# EasyEDA Pro project ByByte_nano.epro, schematic main
Board Name: Board1; Create Date: 2025-09-03; Page Name: P1; Project Name: Бабай (ByByte) Nano; Schematic Name: main; Update Date: 2026-05-24; Company: EasyEDA.com; Page Size: A4; Version: V1.0
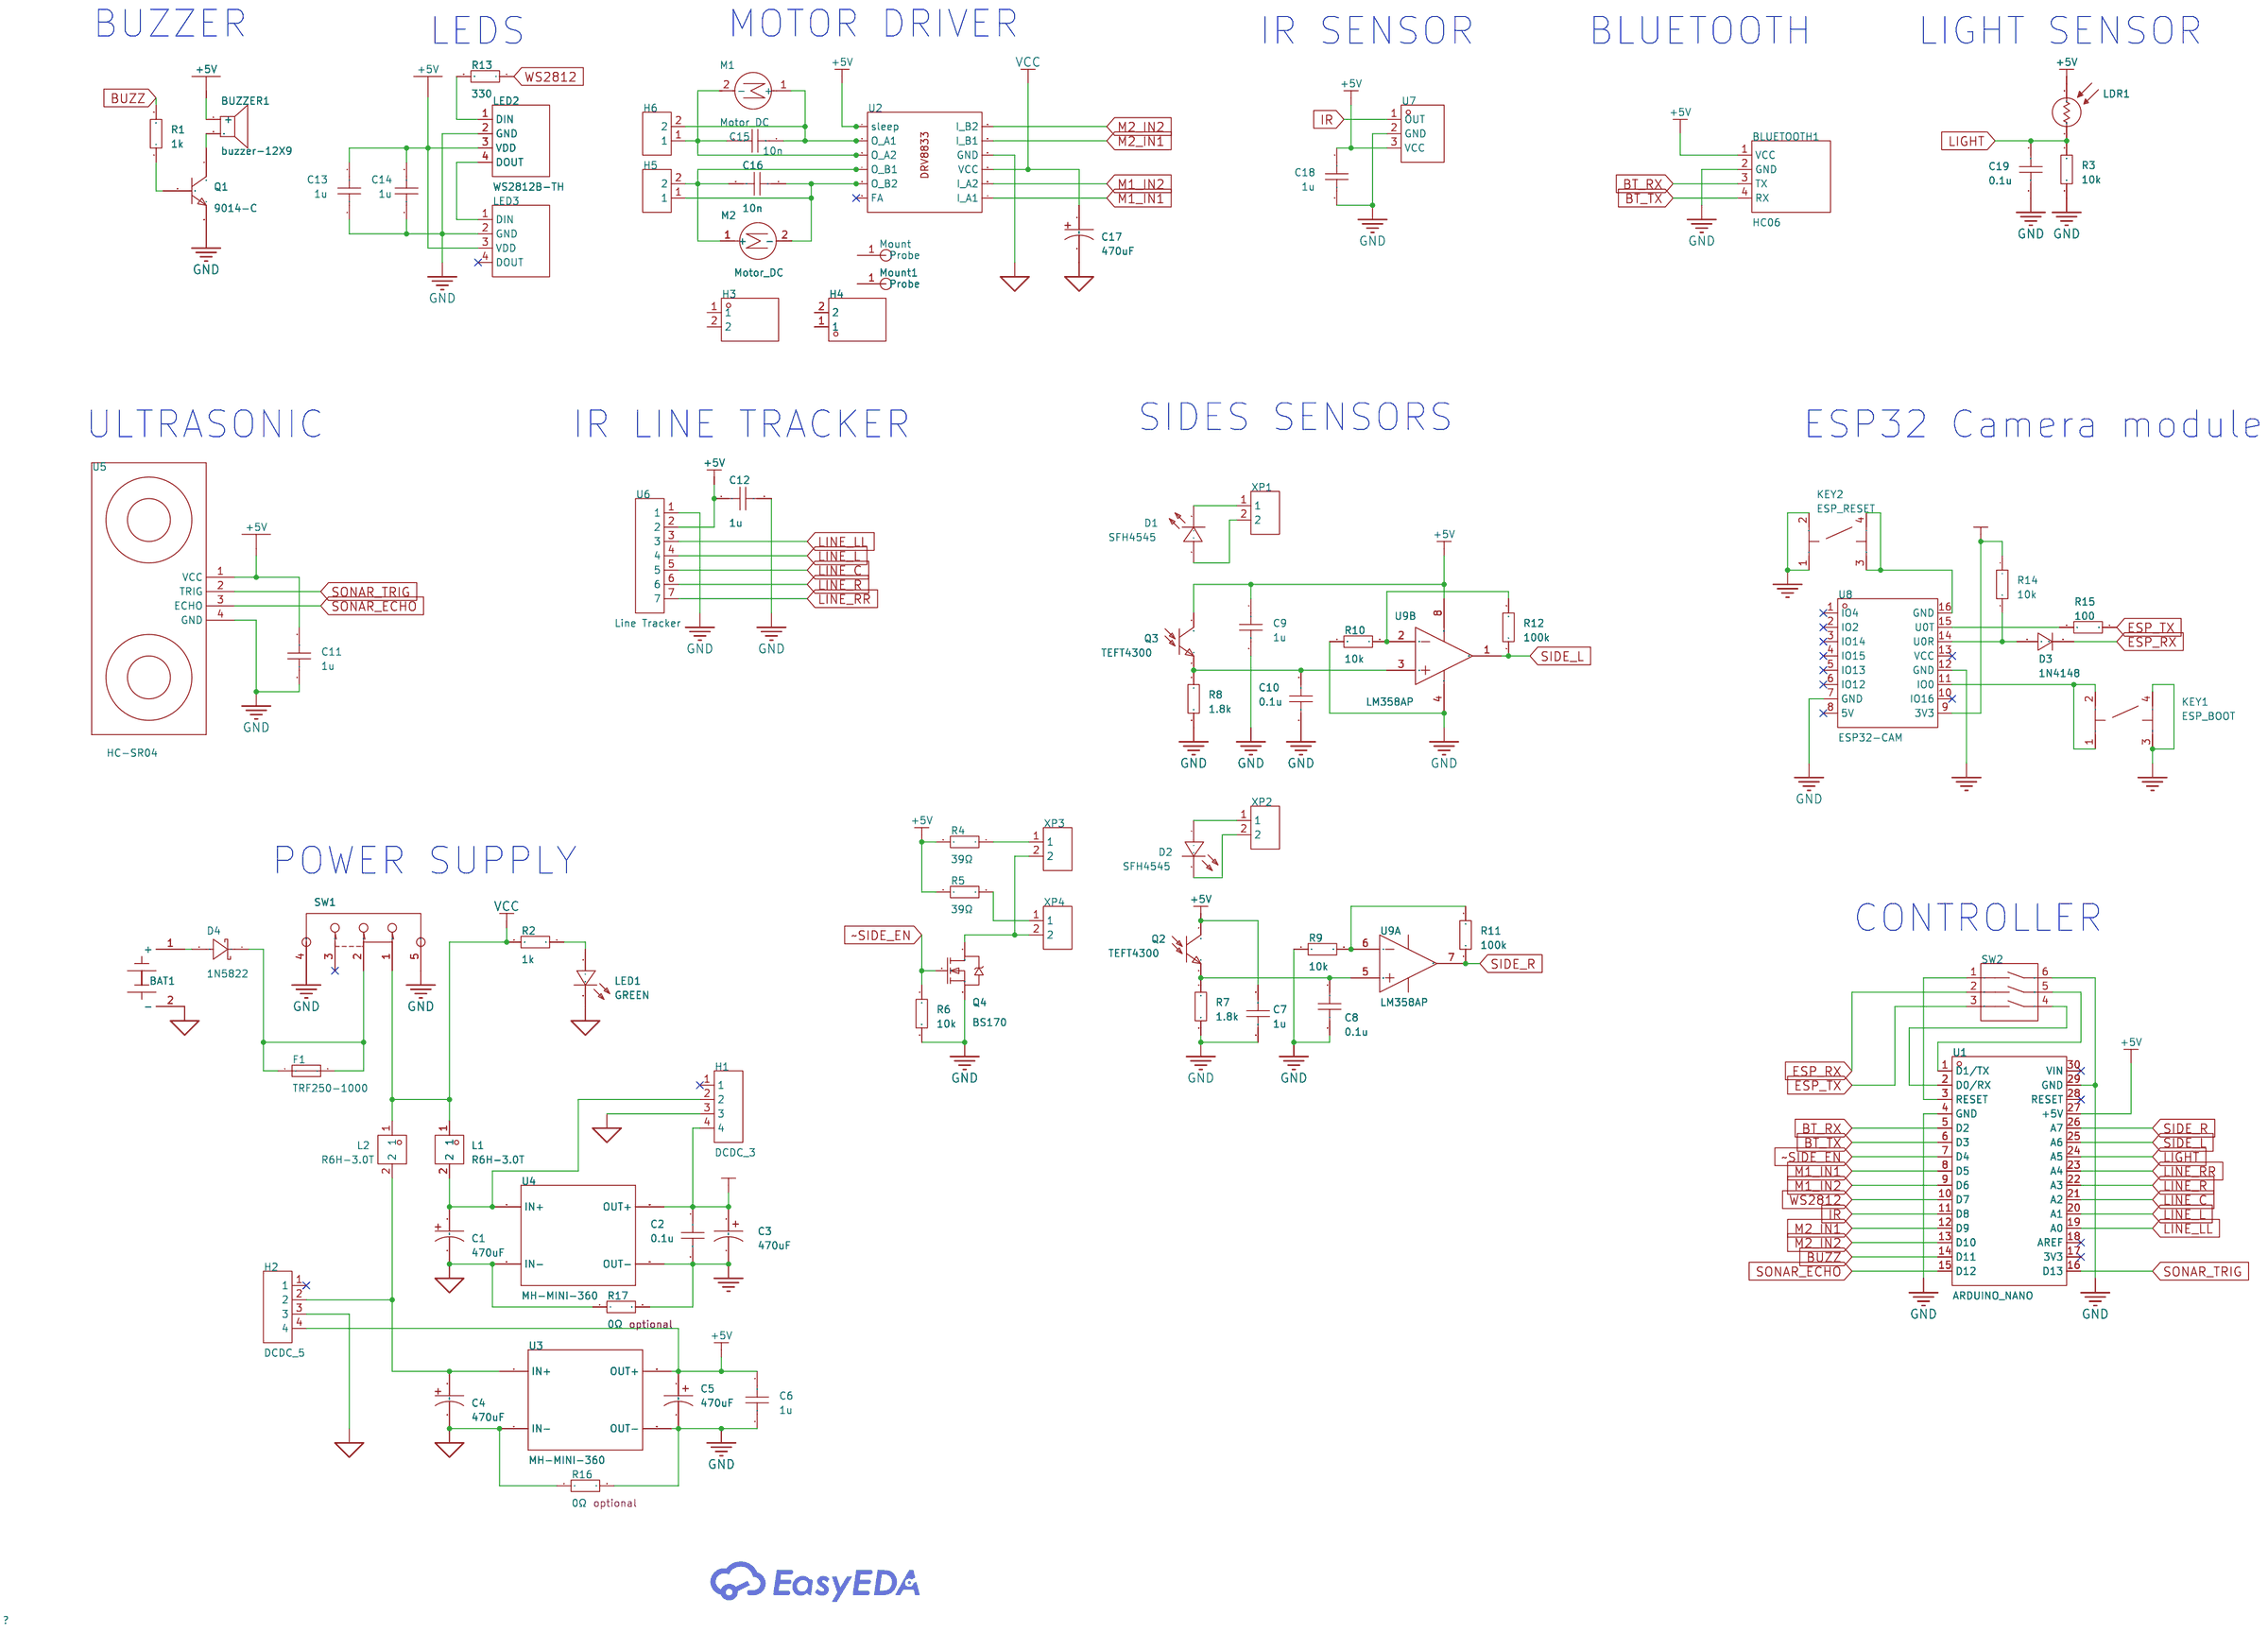
[diagram p0: schematic sheet]

## Parts
BAT1  -  [9V BATTERY]
BLUETOOTH1  HC06  [HC06]
BUZZER1  buzzer-12X9  [BUZ-TH_BD12.0-P7.60-D0.6-FD]
C1  470uF  [CAP-TH_BD8.0-P3.50-D0.6-FD-2]
C2  0.1u  [CAP-TH_L5.0-W2.5-P5.00-D1.0]
C3  470uF  [CAP-TH_BD6.3-P2.50-D1.0-FD]
C4  470uF  [CAP-TH_BD8.0-P3.50-D0.6-FD-2]
C5  470uF  [CAP-TH_BD6.3-P2.50-D1.0-FD]
C6  1u  [CAP-TH_L5.0-W2.5-P5.00-D1.0]
C7  1u  [CAP-TH_L5.0-W2.5-P5.00-D1.0]
C8  0.1u  [CAP-TH_L4.0-W2.5-P2.50-D0.5]
C9  1u  [CAP-TH_L5.0-W2.5-P5.00-D1.0]
C10  0.1u  [CAP-TH_L5.0-W2.5-P5.00-D1.0]
C11  1u  [CAP-TH_L5.0-W2.5-P5.00-D1.0]
C12  1u  [CAP-TH_L5.0-W2.5-P5.00-D1.0]
C13  1u  [CAP-TH_L5.0-W2.5-P5.00-D1.0]
C14  1u  [CAP-TH_L5.0-W2.5-P5.00-D1.0]
C15  10n  [CAP-TH_L4.0-W2.5-P2.50-D0.5]
C16  10n  [CAP-TH_L4.0-W2.5-P2.50-D0.5]
C17  470uF  [CAP-TH_BD8.0-L11.5-P3.50-D0.60]
C18  1u  [CAP-TH_L5.0-W2.5-P5.00-D1.0]
C19  0.1u  [CAP-TH_L4.0-W2.5-P2.50-D0.5]
D1  SFH4545  [LED-TH_BD5.0-P2.54-FD]
D2  SFH4545  [LED-TH_BD5.0-P2.54-FD]
D3  1N4148  [DO-35_BD2.0-L4.0-P8.0-D0.5-RD]
D4  1N5822  [Diode_THT:D_DO-15_P5.08mm_Vertical_KathodeUp]
F1  TRF250-1000  [FUSE-TH_L13.5-W3.7-P5.00-D0.8-S1.80]
H1  DCDC_3  [HDR-TH_4P-P2.54-V-F]
H2  DCDC_5  [HDR-TH_4P-P2.54-V-F]
H3  A2541HWR-2P  [HDR-TH_2P-P2.54-H-W8.7_A2541HWR-2P]
H4  A2541HWR-2P  [HDR-TH_2P-P2.54-H-W8.7_A2541HWR-2P]
H5  Jumper2  [HDR-TH_2P-P2.54-V-M-1]
H6  Jumper2  [HDR-TH_2P-P2.54-V-M-1]
KEY1  ESP_BOOT  [KEY-TH_4P-L6.0-W6.0-P6.50-LS4.5]
KEY2  ESP_RESET  [KEY-TH_4P-L6.0-W6.0-P6.50-LS4.5]
L1  R6H-3.0T  [TH_R6H-610-3T]
L2  R6H-3.0T  [TH_R6H-610-3T]
LDR1  -  [PHOTO_RESISTOR]
LED1  PWR  [LED-TH_BD3.0-P2.54-FD-GREEN]
LED2  WS2812B-TH  [LED-TH_4P-BD5.8_WS2812B-TH]
LED3  WS2812B-TH  [LED-TH_4P-BD5.8_WS2812B-TH]
M1  Motor_DC  [N20_DC_MOTOR 3D]
M2  Motor_DC  [N20_DC_MOTOR 3D]
Mount  -  [PROBE_PAD]
Mount1  -  [PROBE_PAD]
Q1  9014-C  [TO-92-3_L4.8-W3.7-P2.54-R]
Q2  TEFT4300  [SENSOR-TH_TEFT4300]
Q3  TEFT4300  [SENSOR-TH_TEFT4300]
Q4  BS170  [TO-92-3_L4.8-W3.7-P2.54-L]
R1  1k  [RES-TH_BD2.2-L6.5-P10.50-D0.6]
R2  1k  [RES-TH_BD1.8-L3.2-P7.20-D0.4]
R3  10k  [RES-TH_BD1.8-L3.2-P7.20-D0.4]
R4  39Ω  [R_AXIAL-0.4]
R5  39Ω  [R_AXIAL-0.4]
R6  10k  [RES-TH_BD1.8-L3.2-P7.20-D0.4]
R7  1.8k  [RES-TH_BD1.8-L3.2-P7.20-D0.4]
R8  1.8k  [RES-TH_BD1.8-L3.2-P7.20-D0.4]
R9  10k  [RES-TH_BD1.8-L3.2-P7.20-D0.4]
R10  10k  [RES-TH_BD1.8-L3.2-P7.20-D0.4]
R11  100k  [RES-TH_BD1.8-L3.2-P7.20-D0.4]
R12  100k  [RES-TH_BD1.8-L3.2-P7.20-D0.4]
R13  330  [RES-TH_BD1.8-L3.2-P7.20-D0.4]
R14  10k  [RES-TH_BD1.8-L3.2-P7.20-D0.4]
R15  100  [RES-TH_BD1.8-L3.2-P7.20-D0.4]
R16  0Ω  [RES-TH_BD1.8-L3.2-P7.20-D0.4]
R17  0Ω  [RES-TH_BD1.8-L3.2-P7.20-D0.4]
SW1  SW-TH_HOOYA_SS-12D11G4  [SW-TH_HOOYA_SS-12D11G4]
SW2  KF1001-03P-B0-GL-DFT-01B  [SW-TH_6P-L9.9-W9.0-P2.54-LS7.6_BLUE]
U1  ARDUINO_NANO  [COMM-TH_ARDUINO_NANO]
U2  -  [DRV8833]
U3  MH-MINI-360  [DC-DC-STEP-DOWN-MP2307]
U4  MH-MINI-360  [DC-DC-STEP-DOWN-MP2307]
U5  HC-SR04  [ULTRASONIC-HC-SR04#V]
U6  Line Tracker  [HDR-TH_7P-P2.54-V-F]
U7  D38  [OPTO-TH_VS1838B]
U8  ESP32-CAM  [COMM-TH_16P-L40.0-W27.0-P2.54_ESP32-CAM]
U9  LM358AP  [DIP-8_L9.7-W6.4-P2.54-LS7.6-BL]  (sections 1,2)
XP1  Jumper2  [HDR-TH_2P-P2.54-V-M-1]
XP2  Jumper2  [HDR-TH_2P-P2.54-V-M-1]
XP3  Jumper2  [HDR-TH_2P-P2.54-V-M-1]
XP4  Jumper2  [HDR-TH_2P-P2.54-V-M-1]

## Library data of the parts
BAT1 = BH9VPC: https://www.digikey.com/en/products/detail/mpd-memory-protection-devices/BH9VPC/31510
BLUETOOTH1 = HC06: Supplier: LCSC; _: 3
BUZZER1 = BUZZER-12X9: Supplier Part: C9900016920; Supplier Footprint: BUZZER_SMT_9650B; Datasheet: https://atta.szlcsc.comnull; Supplier: LCSC
C1 C4 C17 = RXW471M1CBK-0811: Capacitance:470uF Tolerance:±20% Tolerance:±20% Voltage Rating:16V Ripple Current:- Equivalent Series Resistance(ESR):- Pin Spacing:3.5mm Diameter:8mm Height - Seated (Max):11.5mm Lifetime:5000hrs@105℃; LCSC Part Name: 470uF ±20% 16V; Supplier Part: C134658; Manufacturer: Lelon(立隆); Supplier Footprint: 插件,D8xL11.5mm; JLCPCB Part Class: Extended Part; Datasheet: https://atta.szlcsc.com/upload/public/pdf/source/20190613/C384650_EFEC9297B5607DDE202AAAD5E3F76F5E.pdf; Supplier: LCSC; Tolerance: ±20%; Voltage Rating: 16V; Pin Spacing: 3.5mm; Diameter: 8mm; Height - Seated (Max): 11.5mm; Lifetime: 5000hrs@105℃
C2 C6 C7 C9-C14 C18 = 100nF: Supplier Part: C9900015256; JLCPCB Part Class: Extended Part; Supplier: LCSC
C3 C5 = SHW470UF6.3V6.3X11: Capacitance:470uF Tolerance:±20% Tolerance:±20% Voltage Rating:6.3V Ripple Current:- Equivalent Series Resistance(ESR):- Pin Spacing:2.5mm Diameter:6.3mm Height - Seated (Max):11mm Lifetime:10000hrs@105℃; LCSC Part Name: 470uF ±20% 6.3V 停产; Supplier Part: C494546; Manufacturer: KNSCHA(科尼盛); Supplier Footprint: 插件,D6.3xL11mm; JLCPCB Part Class: Extended Part; Datasheet: https://item.szlcsc.com/datasheet/SHW470UF6.3V6.3X11/505122.html; Supplier: LCSC; Tolerance: ±20%; Voltage Rating: 6.3V; Pin Spacing: 2.5mm; Diameter: 6.3mm; Height - Seated (Max): 11mm; Lifetime: 10000hrs@105℃
C8 C15 C16 C19 = FK18X5R1C105K: Capacitance: Tolerance:±10% Tolerance:±10% Voltage Rated: Temperature Coefficient:; LCSC Part Name: 1uF ±10% 16V; Supplier Part: C3693472; Manufacturer: TDK; JLCPCB Part Class: Extended Part; Datasheet: https://atta.szlcsc.com/upload/public/pdf/source/20171113/C140866_15105613015131115783.pdf; Supplier: LCSC; Tolerance: ±10%
D1 D2 = SFH4550: Supplier Part: C706747; Supplier: LCSC
D3 = 1N4148: Diode Configuration: Forward Voltage (Vf@If):- Reverse Voltage (Vr):- Average Rectified Current (Io):- Reverse Leakage Current:-; Supplier Part: C13769; Supplier Footprint: DO-35; JLCPCB Part Class: Extended Part; Supplier: LCSC
D4 = SR260: Diode Configuration:- Forward Voltage (Vf@If):700mV@2A Reverse Voltage (Vr):60V Rectified Current:2A Reverse Leakage Current (Ir):500uA@60V; LCSC Part Name: 电压:60V 电流:2A 停产; Supplier Part: C845406; Manufacturer: TF(拓锋); Supplier Footprint: DO-15; JLCPCB Part Class: Extended Part; Datasheet: https://atta.szlcsc.com/upload/public/pdf/source/20201103/C845406_FC0B483EC48C96AC55EDB1AB9BB06A33.pdf; Supplier: LCSC; Forward Voltage (Vf@If): 700mV@2A; Reverse Voltage (Vr): 60V; Rectified Current: 2A; Reverse Leakage Current (Ir): 500uA@60V
F1 = TRF250-1000: Supplier Part: C9900004495; Supplier Footprint: 插件; JLCPCB Part Class: Extended Part; Supplier: LCSC
H1 H2 = HC-08蓝牙: Supplier Part: C9900016778; Supplier Footprint: HDR-TH_4P; JLCPCB Part Class: Extended Part; Supplier: LCSC
H3 H4 = A2541HWR-2P: Holes Structure:1x2P Pitch:2.54mm Row Spacing:- Circular Hole / Square Hole:方孔 Mounting Type:Right-Angle Number of Rows:Plugin Number of Holes:2P Current Rating (Max):3A Voltage Rating (Max):250V Holes Direction:side Insulation Height:2.5mm Contact Materi; LCSC Part Name: 1x2P 间距:2.54mm 弯插; Supplier Part: C225510; Manufacturer: CJT(长江连接器); Supplier Footprint: 弯插,P=2.54mm; JLCPCB Part Class: Extended Part; Datasheet: https://atta.szlcsc.com/upload/public/pdf/source/20180724/C239359_48B1BC0CA1B4E4396A63955AAFD15564.pdf; Supplier: LCSC; Holes Structure: 1x2P; Pitch: 2.54mm; Circular Hole / Square Hole: 方孔; Mounting Type: Right-Angle; Number of Rows: Plugin; Number of Holes: 2P; Current Rating (Max): 3A; Voltage Rating (Max): 250V; Holes Direction: side; Insulation Height: 2.5mm; Contact Material: Brass; Contact Plating: Gold; Operating Temperature Range: -40℃~+105℃; PIN Length: 3.2mm
H5 H6 XP1-XP4 = Jumper2: Supplier Part: C2940092; Supplier Footprint: HDR-TH-2P-2.54mm; JLCPCB Part Class: Extended Part; Supplier: LCSC
KEY1 KEY2 = AN6*6: Supplier Part: C9900018275; Supplier Footprint: KEY-TH_4P-L6.0-W6.0-P4.50-LS6.50; JLCPCB Part Class: Extended Part; Supplier: LCSC
L1 L2 = R6H-6*10 -3T: Supplier Part: C2895497; Supplier Footprint: TH-2_P3.50mm; Supplier: LCSC
LDR1 = Photo-Resistor
LED1 = 插针式LEDF3: Supplier Part: C9900017231; Manufacturer Part: GREEN; Supplier Footprint: LED-TH_BD3.0; JLCPCB Part Class: Extended Part; Supplier: LCSC
LED2 LED3 = WS2812B-TH: Supplier: LCSC; Supplier Part: C9900193997; Supplier Footprint: 插件
M1 M2 = Motor_DC: license: https://www.gnu.org/licenses/lgpl-2.1.html
Mount Mount1 = Probe
Q1 = 9014-C: type:NPN Current - Collector(Ic): Collector - Emitter Voltage VCEO: Pd - Power Dissipation: DC Current Gain:200@1mA,5V DC Current Gain:200@1mA,5V Transition frequency(fT):270MHz Current - Collector Cutoff:50nA Vce Saturation(VCE(sat)):140mV Operating Temp; Supplier Part: C305409; Manufacturer: BLUE ROCKET(蓝箭); Supplier Footprint: TO-92-3; Datasheet: https://atta.szlcsc.com/upload/public/pdf/source/20181016/C305409_957E989EA97400765401B68B49A4FDD8.pdf; Supplier: LCSC; type: NPN; DC Current Gain: 200@1mA,5V; Transition frequency(fT): 270MHz; Current - Collector Cutoff: 50nA; Vce Saturation(VCE(sat)): 140mV
Q2 Q3 = TEFT4300: Transistor Type:NPN Collector Emitter Voltage:70V Collector Emitter Voltage:70V Collector Current (Ic):50mA Dissipation Power(Max):100mW Collector Dark Current:1nA Peak Wavelength:925nm Viewing Angle:±30° Operating Temperature:-40℃~+100℃ Operating Tempera; LCSC Part Name: 925nm的NPN光电三极管; Supplier Part: C118301; Manufacturer: VISHAY(威世); Supplier Footprint: 插件,D=3mm; JLCPCB Part Class: Extended Part; Datasheet: https://atta.szlcsc.com/upload/public/pdf/source/20170713/C118301_1499918878961816729.pdf; Supplier: LCSC; Transistor Type: NPN; Collector Emitter Voltage: 70V; Collector Current (Ic): 50mA; Dissipation Power(Max): 100mW; Collector Dark Current: 1nA; Peak Wavelength: 925nm; Viewing Angle: ±30°; Operating Temperature: -40℃~+100℃
Q4 = BS170-D26Z: Type:1 N-Channel Drain Source Voltage (Vdss): Continuous Drain Current (Id): Drain Source On Resistance (RDS(on)@Vgs,Id):5Ω@10V,200mA Power Dissipation (Pd): Gate Threshold Voltage (Vgs(th)@Id):3V@1mA Input Capacitance (Ciss@Vds):40pF@10V Operating Temper; LCSC Part Name: 1个N沟道 耐压:60V 电流:500mA; Supplier Part: C258163; Manufacturer: onsemi(安森美); Supplier Footprint: TO-92-3; JLCPCB Part Class: Extended Part; Datasheet: https://atta.szlcsc.com/upload/public/pdf/source/20180829/C258163_1806696338258A85C7E3E0B8B7F025DB.pdf; Supplier: LCSC; Type: 1 N-Channel; Drain Source On Resistance (RDS(on)@Vgs,Id): 5Ω@10V,200mA; Gate Threshold Voltage (Vgs(th)@Id): 3V@1mA; Input Capacitance (Ciss@Vds): 40pF@10V; Operating Temperature: -55℃~+150℃@(Tj)
R1 = CFR0W4J0102A50: Type:Carbon Resister Resistance:1000Ω Tolerance:±5% Tolerance:±5% Overload Voltage (Max):250V Power(Watts):0.25W; LCSC Part Name: 1kΩ ±5% 250mW 碳膜电阻; Supplier Part: C61293; Supplier Footprint: 插件; JLCPCB Part Class: Extended Part; Supplier: LCSC; Type: Carbon Resister; Tolerance: ±5%; Overload Voltage (Max): 250V; Power(Watts): 0.25W
R2 R3 R6-R15 = Res_AXIAL-1/8W: Supplier Footprint: Through
R4 R5 = Res_AXIAL-1/4W: Supplier Footprint: Through
R16 R17 = Res_AXIAL-1/8W: optional; Supplier Footprint: Through
SW1 = SW-TH_HOOYA_SS-12D11G4: link: https://atta.szlcsc.com/upload/public/pdf/source/20220518/EE8C01AB75DB93BD50D8A6D13330ACA3.pdf
SW2 = KF1001-03P-B0-GL-DFT-01B: Type:Slide, Rocked Circuit:SPST Number of Positions:3 Lead Pitch:2.54mm Current Rating:25mA Voltage Rating:24V Operating Temperature:-40℃~+85℃ Operating Temperature:-40℃~+85℃ Operating Life:2,000 cycles; LCSC Part Name: 2.54mm 平拨,凸起式 3位; Supplier Part: C2897603; Manufacturer: 凯峰; Supplier Footprint: 插件; JLCPCB Part Class: Extended Part; Datasheet: https://item.szlcsc.com/datasheet/KF1001-03P-B0-GL-DFT-01B/3143633.html; Supplier: LCSC; Type: Slide, Rocked; Circuit: SPST; Number of Positions: 3; Lead Pitch: 2.54mm; Current Rating: 25mA; Voltage Rating: 24V; Operating Temperature: -40℃~+85℃; Operating Life: 2,000 cycles
U1 = ARDUINO_NANO: Supplier Part: C9900017879; Supplier Footprint: 插件; JLCPCB Part Class: Extended Part; Supplier: LCSC
U2 = DRV8833
U3 U4 = #promini_DC-DC-STEP-DOWN-MP2307_
U5 = ULTRASONIC-HC-SR04_#V
U6 = 7位插座: Supplier Part: C9900023763; Supplier Footprint: HDR-TH-7P; JLCPCB Part Class: Extended Part; Supplier: LCSC
U7 = VS1838B: Supplier Part: C9900002107; Supplier Footprint: TH-3_4.8X6.7X2.54P; Supplier: LCSC
U8 = ESP32-CAM: ESP32-CAM_AI-THINKER; Supplier Part: C277946; Manufacturer: Ai-Thinker(安信可); Supplier Footprint: 插件; JLCPCB Part Class: Extended Part; Datasheet: https://atta.szlcsc.com/upload/public/pdf/source/20180906/C277946_000C39242C68478A3C556AF60BF76A1F.pdf; Supplier: LCSC
U9 = LM358AP: Number of Circuits:双路 Gain Bandwidth Product(GBP):700kHz Current - Input Bias(Ib):15nA Slew Rate(SR):0.3V/us Output Current:40mA -3db Bandwidth:- Operating Temperature:0℃~+70℃ Operating Temperature:0℃~+70℃; LCSC Part Name: 行业标准双路运算放大器; Supplier Part: C163528; Manufacturer: TI(德州仪器); Supplier Footprint: DIP-8; JLCPCB Part Class: Extended Part; Datasheet: https://www.ti.com/cn/lit/gpn/lm358a; Supplier: LCSC; Number of Circuits: 双路; Gain Bandwidth Product(GBP): 700kHz; Current - Input Bias(Ib): 15nA; Slew Rate(SR): 0.3V/us; Output Current: 40mA; Operating Temperature: 0℃~+70℃

## Nets
+3.3V: C2.1 C3.1 H1.4 R14.1 U4.OUT+ U8.9(3V3)
+5V: BLUETOOTH1.1(VCC) BUZZER1.1(+) C5.1 C6.1 C7.1 C9.1 C11.2 C12.1 C13.1 C14.1 C18.1 H2.4 LDR1.1 LED2.3(VDD) LED3.3(VDD) Q2.1(C) Q3.1(C) R4.2 R5.1 U1.27(+5V) U2.1(sleep) U3.OUT+ U5.1(VCC) U6.2 U7.3(VCC) U9.8(VCC)
GND: BLUETOOTH1.2(GND) C5.2 C6.2 C7.2 C8.2 C9.2 C10.2 C11.1 C12.2 C13.2 C14.2 C18.2 C19.2 LED2.2(GND) LED3.2(GND) Q1.3(E) Q4.3(S) R3.1 R6.2 R7.2 R8.2 R9.2 R10.2 R16.2 SW1.4 SW1.5 SW2.6 U1.4(GND) U1.29(GND) U3.OUT- U5.4(GND) U6.1 U7.2(GND) U8.7(GND) U9.4(GND)
PGND: BAT1.2(-) C1.2 C4.2 C17.2 H1.3 H2.3 LED1.2(K) R16.1 R17.1 U2.10(GND) U3.IN- U4.IN-
VCC: C17.1 L1.1 L2.1 R2.2 SW1.1 U2.9(VCC)
BT_RX: BLUETOOTH1.3(TX) U1.5(D2)
BT_TX: BLUETOOTH1.4(RX) U1.6(D3)
BUZZ: R1.2 U1.14(D11)
ESP_GND: C2.2 C3.2 KEY1.3 KEY1.4 KEY2.1 KEY2.2 R17.2 U4.OUT- U8.12(GND)
ESP_RX: D3.1 SW2.2
ESP_TX: R15.2 SW2.3
IR: U1.11(D8) U7.1(OUT)
LIGHT: C19.1 LDR1.2 R3.2 U1.24(A5)
LINE_C: U1.21(A2) U6.5
LINE_L: U1.20(A1) U6.4
LINE_LL: U1.19(A0) U6.3
LINE_R: U1.22(A3) U6.6
LINE_RR: U1.23(A4) U6.7
M1_IN1: U1.8(D5) U2.7(I_A1)
M1_IN2: U1.9(D6) U2.8(I_A2)
M2_IN1: U1.12(D9) U2.11(I_B1)
M2_IN2: U1.13(D10) U2.12(I_B2)
SIDE_L: R12.1 U1.25(A6) U9.1(OUTA)
SIDE_R: R11.1 U1.26(A7) U9.7(OUTB)
SONAR_ECHO: U1.15(D12) U5.3(ECHO)
SONAR_TRIG: U1.16(D13) U5.2(TRIG)
WS2812: R13.1 U1.10(D7)
~SIDE_EN: Q4.2(G) R6.1 U1.7(D4)
$1N1464: Q1.2(B) R1.1
$1N1467: BUZZER1.2 Q1.1(C)
$1N1626: LED2.1(DIN) R13.2
$1N1633: LED2.4(DOUT) LED3.1(DIN)
$1N4176: LED1.1(A) R2.1
$1N4272: C15.2 H6.2 M1.1(+) U2.2(O_A1)
$1N4279: C15.1 H6.1 M1.2(-) U2.3(O_A2)
$1N5405: D1.2(K) XP1.1
$1N5529: D2.1(A) XP2.1
$1N7817: SW2.1 U1.3(RESET)
$1N8038: D3.2 R14.2 U8.14(U0R)
$1N8431: KEY1.1 KEY1.2 U8.11(IO0)
$1N8535: KEY2.3 KEY2.4 U8.16(GND)
$1N9044: C16.2 H5.2 M2.1(+) U2.4(O_B1)
$1N9105: C16.1 H5.1 M2.2(-) U2.5(O_B2)
$1N12441: R15.1 U8.15(U0T)
$1N12605: SW2.4 U1.2(D0/RX)
$1N12810: D4.1(K) F1.1 F1.2 SW1.2
$1N12946: BAT1.1(+) D4.2(A)
$1N16301: D1.1(A) XP1.2
$1N16307: D2.2(K) XP2.2
$1N16316: Q4.1(D) XP3.2 XP4.2
$1N16464: R4.1 XP3.1
$1N16512: R5.2 XP4.1
$1N23882: C10.1 Q3.2(E) R8.1 U9.3(INA+)
$1N23884: C8.1 Q2.2(E) R7.1 U9.5(INB+)
$1N23924: R10.1 R12.2 U9.2(INA-)
$1N24128: R9.1 R11.2 U9.6(INB-)
$1N26344: C4.1 H2.2 L2.2 U3.IN+
$1N41219: C1.1 H1.2 L1.2 U4.IN+
$1N41760: SW2.5 U1.1(D1/TX)

Not connected (* = marked no-connect by the designer): H1 1*; H2 1*; H3 1 2; H4 1 2; LED3 4(DOUT)*; Mount 1(Probe); Mount1 1(Probe); SW1 3*; U1 17(3V3)* 18(AREF)* 28(RESET)* 30(VIN)*; U2 6(FA)*; U8 1(IO4)* 2(IO2)* 3(IO14)* 4(IO15)* 5(IO13)* 6(IO12)* 8(5V)* 10(IO16)* 13(VCC)*

## Notes on the sheet
- BUZZER
- MOTOR DRIVER
- LEDS
- IR SENSOR
- BLUETOOTH
- LIGHT SENSOR
- SIDES SENSORS
- ULTRASONIC
- IR LINE TRACKER
- ESP32 Camera module
- POWER SUPPLY
- CONTROLLER
